# Altium schematic sheet H19R1_Frontend 1.SchDoc
size Letter; CompanyName: Hexabitz; DocumentNumber: 1; SheetNumber: 1; SheetTotal: 3
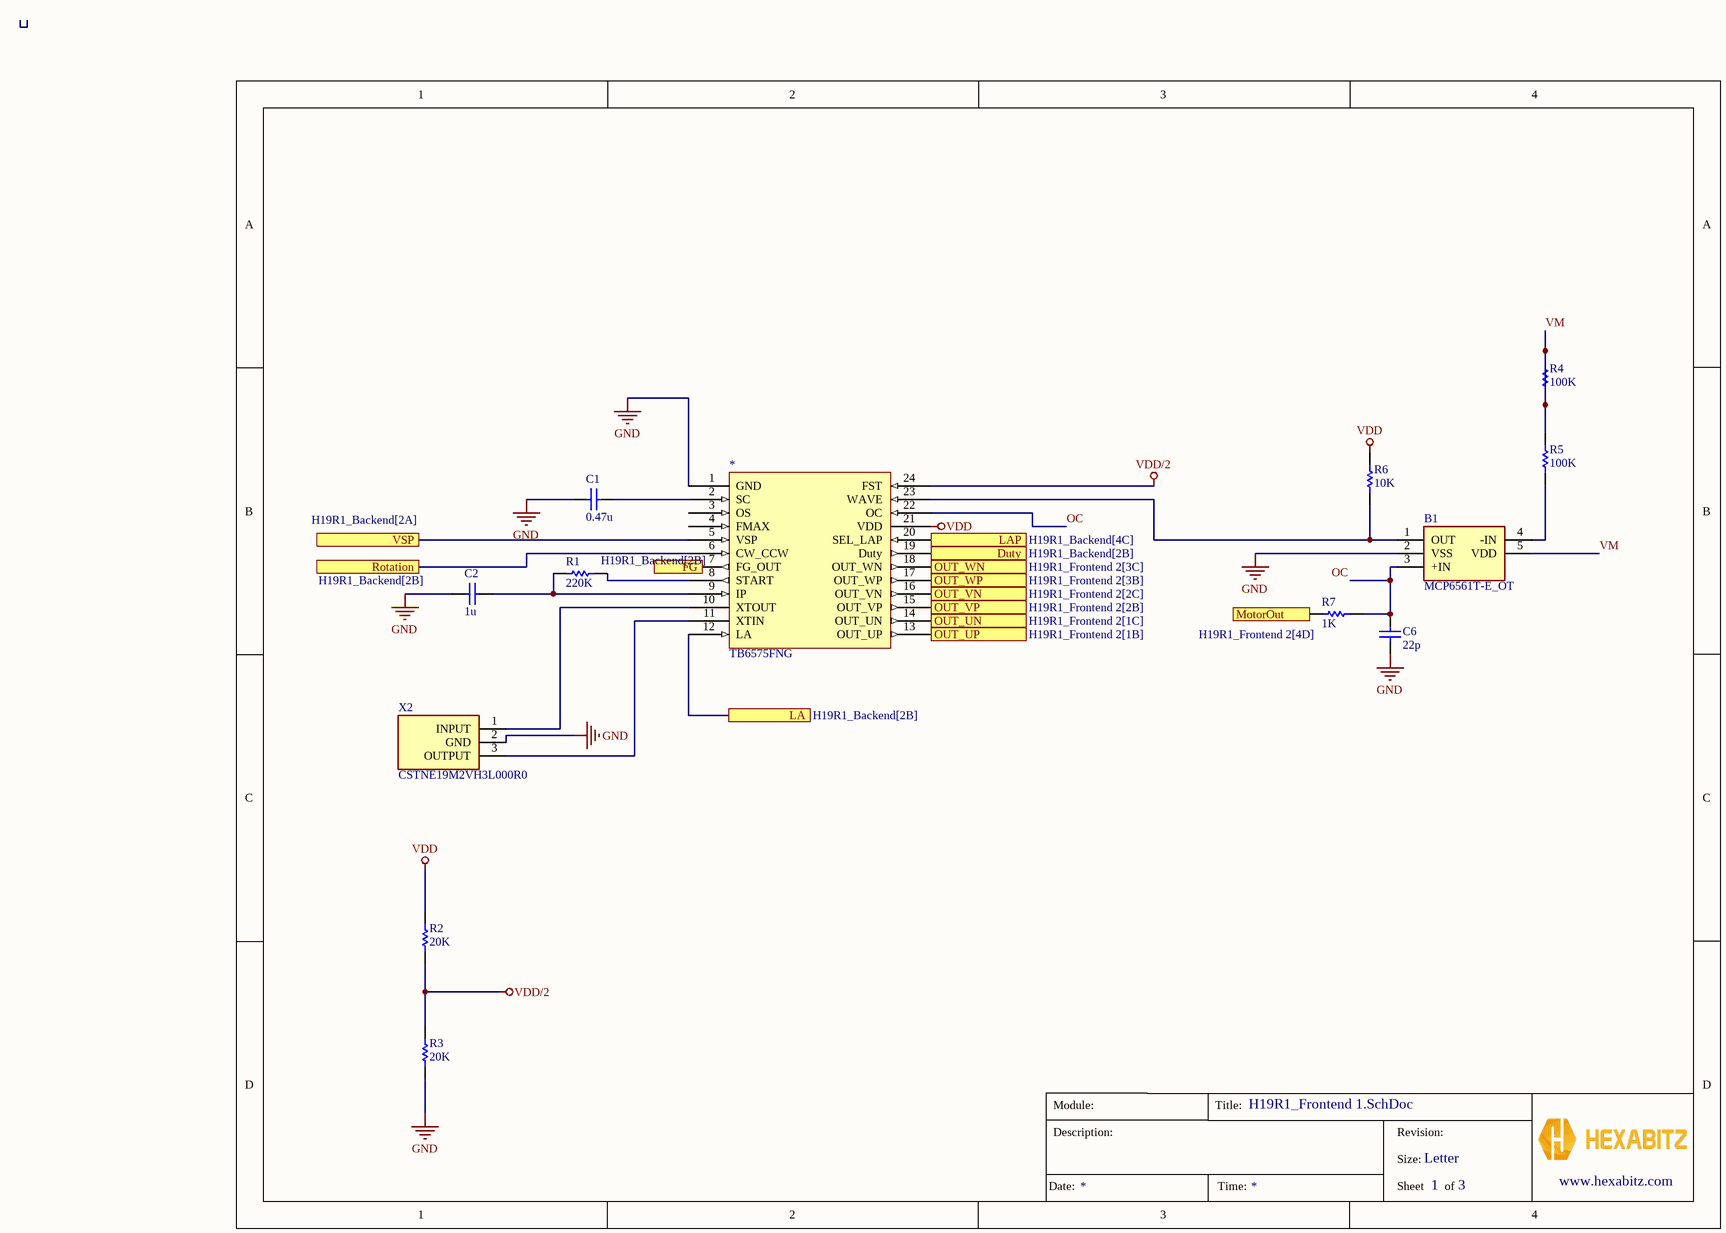
[diagram p0: H19R1_Frontend 1.SchDoc]

## Parts
*  TB6575FNG
B1  MCP6561T-E_OT  [SOT95P270X145-5N]
C1  value 0.47u  (hidden comment: Capacitor)
C2  value 1u  (hidden comment: Capacitor)
C6  value 22p  (hidden comment: Capacitor)
R1  value 220K  (hidden comment: Resistor)
R2  value 20K  (hidden comment: Resistor)
R3  value 20K  (hidden comment: Resistor)
R4  value 100K  (hidden comment: Resistor)
R5  value 100K  (hidden comment: Resistor)
R6  value 10K  (hidden comment: Resistor)
R7  value 1K  (hidden comment: Resistor)
X2  CSTNE19M2VH3L000R0  [CSTNE19M2VH3L000R0]

## Ports
Duty (see H19R1_Backend[2B]), FG (see H19R1_Backend[2B]), LA (see H19R1_Backend[2B]), LAP (see H19R1_Backend[4C]), MotorOut (see H19R1_Frontend 2[4D]), OUT_UN (see H19R1_Frontend 2[1C]), OUT_UP (see H19R1_Frontend 2[1B]), OUT_VN (see H19R1_Frontend 2[2C]), OUT_VP (see H19R1_Frontend 2[2B]), OUT_WN (see H19R1_Frontend 2[3C]), OUT_WP (see H19R1_Frontend 2[3B]), Rotation (see H19R1_Backend[2B]), VSP (see H19R1_Backend[2A])

## Nets
GND: *.1(GND) B1.2(VSS) C1.1 C2.1 C6.1 R3.1 X2.2(GND)
VDD: *.21(VDD) R2.2 R6.2
VDD/2: *.24(FST) R2.1 R3.2
Duty: *.19(Duty) ; port Duty
LA: *.12(LA) ; port LA
LAP: *.20(SEL_LAP) ; port LAP
MotorOut: R7.1 ; port MotorOut
OC: *.22(OC) B1.3(+IN) C6.2 R7.2
OUT_UN: *.14(OUT_UN) ; port OUT_UN
OUT_UP: *.13(OUT_UP) ; port OUT_UP
OUT_VN: *.16(OUT_VN) ; port OUT_VN
OUT_VP: *.15(OUT_VP) ; port OUT_VP
OUT_WN: *.18(OUT_WN) ; port OUT_WN
OUT_WP: *.17(OUT_WP) ; port OUT_WP
Rotation: *.6(CW_CCW) ; port Rotation
VM: B1.5(VDD) R4.1 R4.2 R5.2
VSP: *.5(VSP) ; port VSP
Net*_2: *.2(SC) C1.2
Net*_8: *.8(START) R1.2
Net*_9: *.9(IP) C2.2 R1.1
Net*_10: *.10(XTOUT) X2.1(INPUT)
Net*_11: *.11(XTIN) X2.3(OUTPUT)
Net*_23: *.23(WAVE) B1.1(OUT) R6.1
NetB1_4: B1.4(-IN) R5.1

Not connected (* = marked no-connect by the designer): * 3(OS) 4(FMAX) 7(FG_OUT)

## Notes on the sheet
- Module:
- Title:
- Description:
- Size:
- Revision:
- Letter
- www.hexabitz.com
- Date:
- Time:
- Sheet
- of

## Library data of the parts
B1 = MCP6561T-E_OT: Single 1.8V Push/Pull Comparator, E temp; Manufacturer_Name: Microchip; Manufacturer_Part_Number: MCP6561T-E/OT; Geometry.Height: 1.45mm; Avnet Part Number: *; Avnet Price/Stock: *; Datasheet Link: https://datasheet.datasheetarchive.com/originals/distributors/Datasheets-DGA6/571611.pdf
C1 C2 C6 = Capacitor: SimulationGenericComponent: True
R1-R7 = Resistor: TC1: 0; SimulationGenericComponent: True; TC2: 0
X2 = CSTNE19M2VH3L000R0: 19.2 MHz Ceramic Resonator Built in Capacitor 15 pF +/-0.11% -40C ~ 85C Surface Mount; Manufacturer_Name: Murata Electronics; Geometry.Height: 1mm; Mouser Part Number: 81-CSTNE19M2VH3L000R; Mouser Price/Stock: https://www.mouser.co.uk/ProductDetail/Murata-Electronics/CSTNE19M2VH3L000R0?qs=w%2Fv1CP2dgqpVNBOCkpNc0A%3D%3D; Manufacturer_Part_Number: CSTNE19M2VH3L000R0; Datasheet Link: https://www.murata.com/products/productdata/8802046246942/SPEC-CSTNE19M2VH3L000R0.pdf